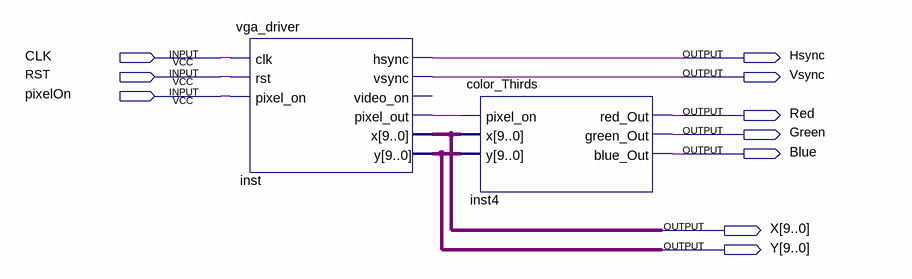
[diagram p0: schematic sheet]
// Quartus schematic colorVGADriver.bdf as structural Verilog: 2 symbols, 10 pins
module colorVGADriver (
  input  CLK,
  input  RST,
  input  pixelOn,
  output Hsync,
  output Vsync,
  output Red,
  output Green,
  output Blue,
  output [9:0] X,
  output [9:0] Y
);

  wire inst_pixel_out;

  vga_driver inst (
    .clk(CLK), .rst(RST), .pixel_on(pixelOn), .hsync(Hsync), .vsync(Vsync), .pixel_out(inst_pixel_out),
    .x(X), .y(Y));  // open: video_on
  color_Thirds inst4 (.pixel_on(inst_pixel_out), .x(X), .y(Y), .red_Out(Red), .green_Out(Green), .blue_Out(Blue));
endmodule
